# EAGLE design main1 (EAGLE 9.2.2)
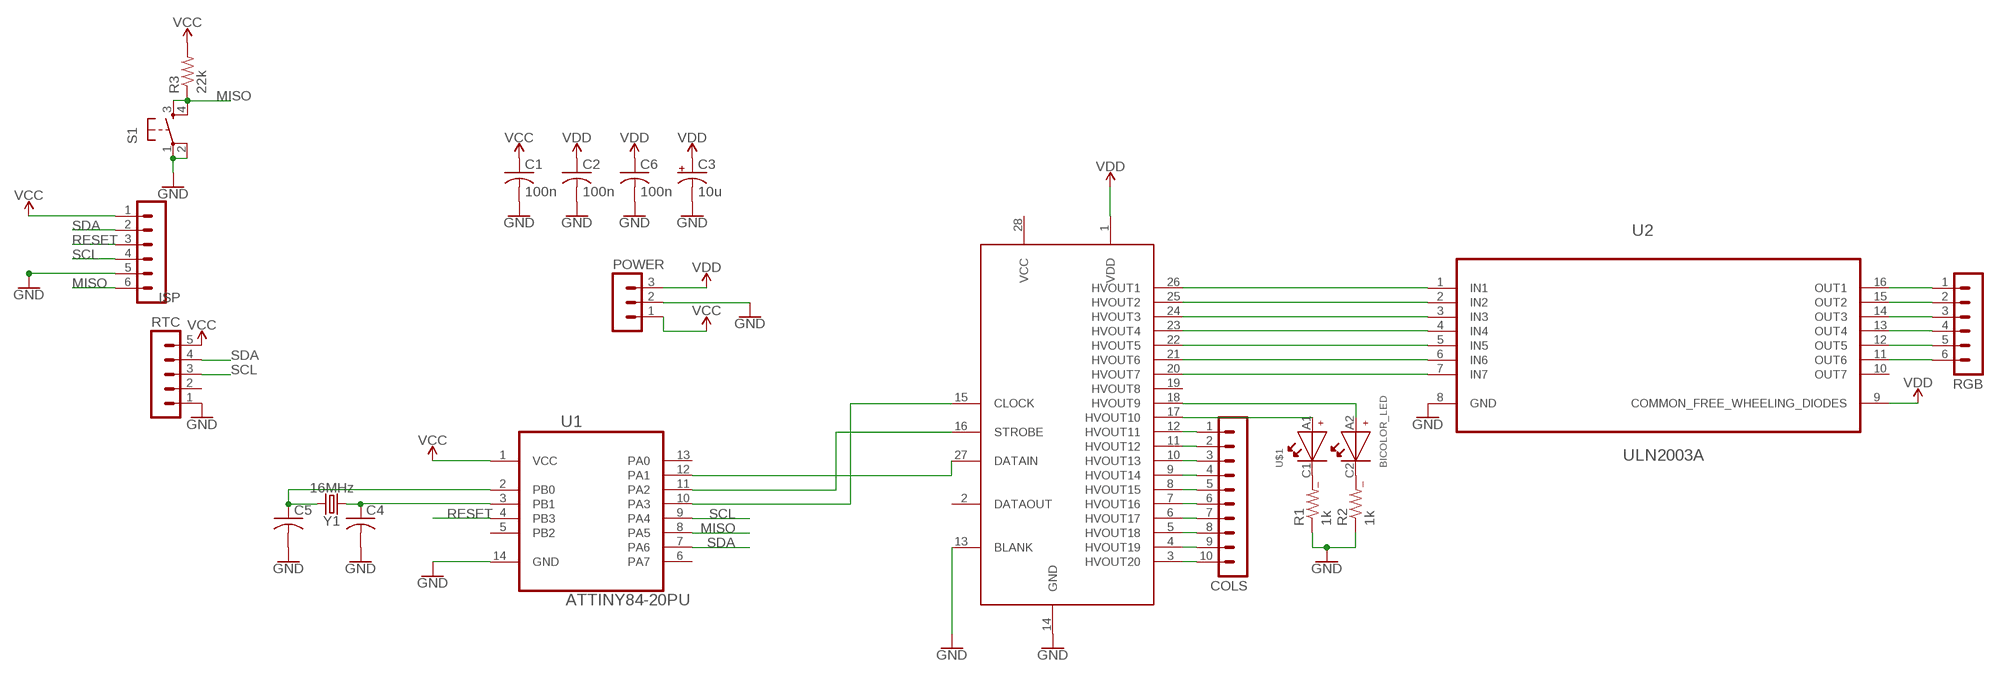
[diagram p0: schematic, sheet 1]

## Parts
C1  100n  C-US025-025X050  [C025-025X050]
C2  100n  C-US025-025X050  [C025-025X050]
C3  10u  CPOL-USE2-5  [E2-5]
C4  C-USC0603K  [C0603K]
C5  C-USC0603K  [C0603K]
C6  100n  C-US025-025X050  [C025-025X050]
COLS  MA10-1W  [MA10-1W]
ISP  MA06-1  [MA06-1]
POWER  MA03-1  [MA03-1]
R1  1k  R-US_R0603  [R0603]
R2  1k  R-US_R0603  [R0603]
R3  22k  R-US_R0603  [R0603]
RGB  MA06-1  [MA06-1]
RTC  MA05-1  [MA05-1]
S1  TAC_SWITCHPTH  [TACTILE-PTH]
U1  ATTINY84-20PU  [DIP254P762X533-14]
U2  ULN2003A  [DIP254P762X508-16]
U$1  BICOLOR_LED  [BICOLOR_LED]
U$2  HV5812  [DIP254P1524X482-28]
Y1  16MHz  CRYSTAL-16MHZPTH-HC49US  [HC49US]

## Nets
GND: C1.2 C2.2 C3.- C4.2 C5.2 C6.2 ISP.5 POWER.2 R1.1 R2.1 RTC.1 S1.1 S1.2 U1.14(GND) U2.8(GND) U$2.13(BLANK) U$2.14(GND)
MISO: ISP.6 R3.1 S1.3 S1.4 U1.8(PA5)
N$1: U2.1(IN1) U$2.26(HVOUT1)
N$2: U2.2(IN2) U$2.25(HVOUT2)
N$3: U2.3(IN3) U$2.24(HVOUT3)
N$4: U2.4(IN4) U$2.23(HVOUT4)
N$5: U2.5(IN5) U$2.22(HVOUT5)
N$6: U2.6(IN6) U$2.21(HVOUT6)
N$7: U2.7(IN7) U$2.20(HVOUT7)
N$8: RGB.1 U2.16(OUT1)
N$9: RGB.2 U2.15(OUT2)
N$10: RGB.3 U2.14(OUT3)
N$11: RGB.4 U2.13(OUT4)
N$12: RGB.5 U2.12(OUT5)
N$13: RGB.6 U2.11(OUT6)
N$14: COLS.1 U$2.12(HVOUT11)
N$15: COLS.2 U$2.11(HVOUT12)
N$16: COLS.3 U$2.10(HVOUT13)
N$17: COLS.4 U$2.9(HVOUT14)
N$18: COLS.5 U$2.8(HVOUT15)
N$19: COLS.6 U$2.7(HVOUT16)
N$20: COLS.7 U$2.6(HVOUT17)
N$21: COLS.8 U$2.5(HVOUT18)
N$22: COLS.9 U$2.4(HVOUT19)
N$23: COLS.10 U$2.3(HVOUT20)
N$24: U$1.A1 U$2.17(HVOUT10)
N$25: U$1.A2 U$2.18(HVOUT9)
N$26: R1.2 U$1.C1
N$27: R2.2 U$1.C2
N$28: U1.10(PA3) U$2.15(CLOCK)
N$29: U1.11(PA2) U$2.16(STROBE)
N$30: U1.12(PA1) U$2.27(DATAIN)
PB0: C5.1 U1.2(PB0) Y1.2
PB1: C4.1 U1.3(PB1) Y1.1
RESET: ISP.3 U1.4(PB3)
SCL: ISP.4 RTC.3 U1.9(PA4)
SDA: ISP.2 RTC.4 U1.7(PA6)
VCC: C1.1 ISP.1 POWER.1 R3.2 RTC.5 U1.1(VCC)
VDD: C2.1 C3.+ C6.1 POWER.3 U2.9(COMMON_FREE_WHEELING_DIODES) U$2.1(VDD)
Unconnected: RTC.2 U1.5(PB2) U1.6(PA7) U1.13(PA0) U2.10(OUT7) U$2.2(DATAOUT) U$2.19(HVOUT8) U$2.28(VCC)

## Library data of the parts
C1 C2 C4-C6 = rcl:C-US: CAPACITOR, American symbol; SPICEPREFIX: C
C3 = rcl:CPOL-US: POLARIZED CAPACITOR, American symbol; SPICEPREFIX: C
COLS = con-lstb:MA10-1W: PIN HEADER; OC_FARNELL: unknown; OC_NEWARK: unknown
ISP RGB = con-lstb:MA06-1: PIN HEADER; OC_FARNELL: unknown; OC_NEWARK: unknown
POWER = con-lstb:MA03-1: PIN HEADER; OC_FARNELL: unknown; OC_NEWARK: unknown
R1-R3 = rcl:R-US_: RESISTOR, American symbol; SPICEPREFIX: R
RTC = con-lstb:MA05-1: PIN HEADER; OC_FARNELL: unknown; OC_NEWARK: unknown
S1 = SparkFun-Retired:TAC_SWITCH: Momentary Switch Button commonly used for reset or general input. Spark Fun Electronics SKU : COM-00097 SMT- SWCH-08247
U1 = Atmel_By_element14_Batch_1-00:ATTINY84-20PU: 8-bit Microcontroller with In-System Programmable Flash; MPN: ATTINY84-20PU; OC_FARNELL: -; OC_NEWARK: 58M3794; PACKAGE: PDIP-14; SUPPLIER: Atmel
U2 = ST Microelctronics_By_element14_Batch_1:ULN2003A: Seven Darlington array; MPN: ULN2003A; OC_FARNELL: 1094421; OC_NEWARK: 89K1130; PACKAGE: 16-DIP; SUPPLIER: STMICROELECTRONICS
U$1 = 7_segment_lib:BICOLOR_LED
U$2 = 7_segment_lib:HV5812
Y1 = SparkFun-Clocks:CRYSTAL-16MHZ: 16MHz Crystal Digikey Example <http://www.digikey.com/product-search/en?keywords=535-9122-1-ND> Frequency: 16MHz Frequency Stability: ±50ppm Frequency Tolerance: ±20ppm Load Capacitance: 18pF SparkFun Products: Pro Micro -5V/16MHz <https://www.sparkfun.com/products/12640> SparkFun Serial Enabled LCD Kit <https://www.sparkfun.com/products/10097>; PROD_ID: XTAL-08181; SF_ID: COM-00536

## Board
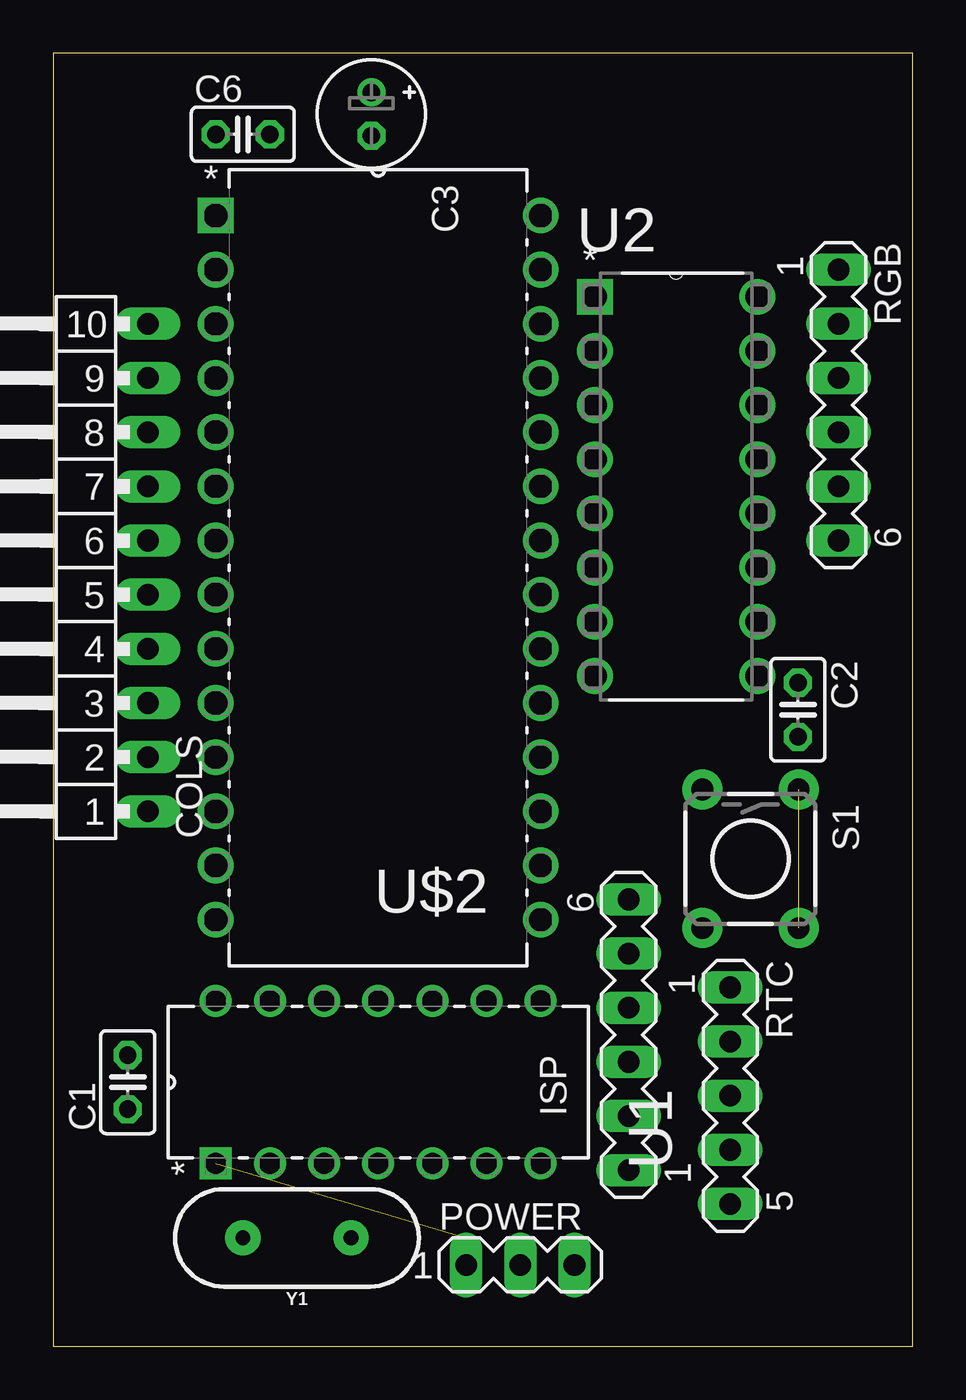
[diagram p1: board, top side]
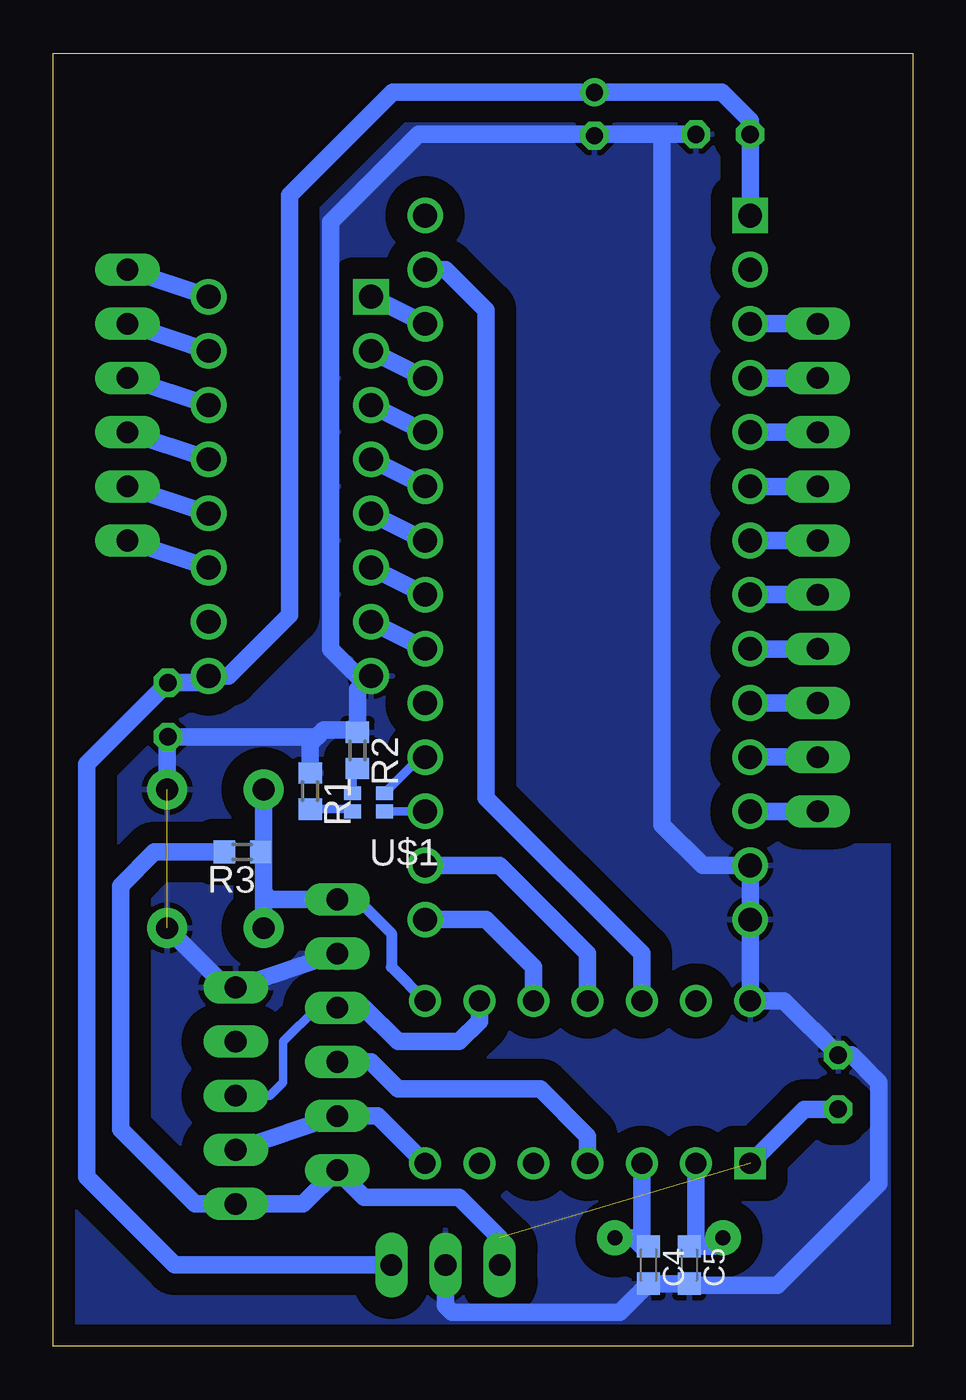
[diagram p2: board, bottom side, seen from below]

Size 40.3 x 60.63 mm. Coordinates in mm from the lower left corner, seen from the top.
Outline: 0,0 40.3,0 40.3,60.63 0,60.63 0,0
Copper layers (1*16): Top 0.035mm / dielectric 1.5mm / Bottom 0.035mm
Design rules "default": minimum track width 6mil, minimum drill 0.35mm, track to track 6mil, track to pad 6mil, pad to pad 6mil, via to via 6mil, smd to smd 6mil, copper to edge 40mil, drill to drill 6mil, minimum pad ring 10mil, minimum via ring 8mil, stop-mask expansion 4mil, vias tented up to drill 0mil, thermal gap 10mil

### Footprints (pad centres in the part's own frame; a part is rotated, then mirrored left to right if it is on the bottom)
C025-025X050 = drill 0.813 octagon: 1 -1.27,0; 2 1.27,0
E2-5 = drill 0.813 pad 1.27: + -1.016,0 | drill 0.813 pad 1.27 octagon: - 1.016,0
C0603K = smd 1.05 x 1.08: 1 -0.875,0; 2 0.875,0
MA10-1W = drill 1.016 long: 1 -11.43,0; 2 -8.89,0; 3 -6.35,0; 4 -3.81,0; 5 -1.27,0; 6 1.27,0; 7 3.81,0; 8 6.35,0; 9 8.89,0; 10 11.43,0
MA06-1 = drill 1.016 long: 1 -6.35,0; 2 -3.81,0; 3 -1.27,0; 4 1.27,0; 5 3.81,0; 6 6.35,0
MA03-1 = drill 1.016 long: 1 -2.54,0; 2 0,0; 3 2.54,0
R0603 = smd 1 x 1.1: 1 -0.85,0; 2 0.85,0
MA05-1 = drill 1.016 long: 1 -5.08,0; 2 -2.54,0; 3 0,0; 4 2.54,0; 5 5.08,0
TACTILE-PTH = drill 1.016 pad 1.88: 1 -3.251,2.261; 2 3.251,2.261; 3 -3.251,-2.261; 4 3.251,-2.261
DIP254P762X533-14 = drill 0.991 square: 1 -7.62,15.24 | drill 0.991: 2 -7.62,12.7; 3 -7.62,10.16; 4 -7.62,7.62; 5 -7.62,5.08; 6 -7.62,2.54; 7 -7.62,0; 8 0,0; 9 0,2.54; 10 0,5.08; 11 0,7.62; 12 0,10.16; 13 0,12.7; 14 0,15.24
DIP254P762X508-16 = drill 1.118 square: 1 -7.62,17.78 | drill 1.118: 2 -7.62,15.24; 3 -7.62,12.7; 4 -7.62,10.16; 5 -7.62,7.62; 6 -7.62,5.08; 7 -7.62,2.54; 8 -7.62,0; 9 0,0; 10 0,2.54; 11 0,5.08; 12 0,7.62; 13 0,10.16; 14 0,12.7; 15 0,15.24; 16 0,17.78
BICOLOR_LED = smd 0.8 x 0.65: A1 0,0; A2 0,-0.85; C1 1.5,0; C2 1.5,-0.85
DIP254P1524X482-28 = drill 1.118 square: 1 -15.24,33.02 | drill 1.118: 2 -15.24,30.48; 3 -15.24,27.94; 4 -15.24,25.4; 5 -15.24,22.86; 6 -15.24,20.32; 7 -15.24,17.78; 8 -15.24,15.24; 9 -15.24,12.7; 10 -15.24,10.16; 11 -15.24,7.62; 12 -15.24,5.08; 13 -15.24,2.54; 14 -15.24,0; 15 0,0; 16 0,2.54; 17 0,5.08; 18 0,7.62; 19 0,10.16; 20 0,12.7; 21 0,15.24; 22 0,17.78; 23 0,20.32; 24 0,22.86; 25 0,25.4; 26 0,27.94; 27 0,30.48; 28 0,33.02
HC49US = drill 0.7 pad 1.651: 1 -2.54,0; 2 2.54,0

### Placement (x,y rotation side)
C1  3.49,12.38 90 top
C2  34.92,29.84 270 top
C3  14.92,57.78 270 top
C4  12.38,3.81 270 bottom
C5  10.48,3.81 270 bottom
C6  8.89,56.83 0 top
COLS  4.45,36.51 90 top
ISP  26.99,14.61 90 top
POWER  21.91,3.81 0 top
R1  28.26,26.04 270 bottom
R2  26.04,27.94 270 bottom
R3  31.43,23.18 180 bottom
RGB  36.83,44.13 270 top
RTC  31.75,11.75 270 top
S1  32.7,22.86 270 top
U1  22.86,16.19 90 top
U2  33.02,31.43 0 top
U$1  24.77,25.08 180 bottom
U$2  22.86,20 0 top
Y1  11.43,5.08 180 top

### Tracks (layer width: path | path; a pad name or v marks a point on that pad's centre or on a via)
GND  (1 unrouted)
  Bottom 0.813: R2.1 26.03,29.21 | 26.03,29.21 26.03,30.8 U2.8 26.03,31.43 27.3,32.7 27.3,52.7 23.18,56.83 14.86,56.83 | C6.2 11.75,56.83 | 11.75,56.83 14.86,56.83 | 14.86,56.83 C3.- | ISP.5 RTC.1 32.18,16.83 S1.2 | S1.1 34.96,28.54 C2.2 27.94,28.57 27.62,28.89 | R1.1 28.26,28.26 27.62,28.89 | 27.62,28.89 26.35,28.89 26.03,29.21 | 11.75,56.83 11.75,24.45 9.84,22.54 U$2.13 U$2.14 U1.14 6.03,16.19 C1.2 2.86,13.65 1.59,12.38 1.59,7.62 6.35,2.86 10.4,2.86 C5.2 C4.2 13.73,1.59 21.59,1.59 21.91,1.91 POWER.2
  pour Bottom (isolate 1.016): 0,60.64 0,48.58 4.45,48.58 4.45,23.5 0,23.5 0,0 40.32,0 40.32,60.64
MISO
  Bottom 0.508: ISP.6 26.03,20.95 24.45,19.37 24.45,17.78 U1.8
  Bottom 0.813: S1.4 30.44,21.27 | 30.44,21.27 S1.3 | R3.1 30.44,23.04 30.44,21.27 | ISP.6 30.12,20.95 30.44,21.27
N$1
  Bottom 0.813: U$2.26 U2.1
N$2
  Bottom 0.813: U$2.25 U2.2
N$3
  Bottom 0.813: U$2.24 U2.3
N$4
  Bottom 0.813: U$2.23 U2.4
N$5
  Bottom 0.813: U$2.22 U2.5
N$6
  Bottom 0.813: U$2.21 U2.6
N$7
  Bottom 0.813: U$2.20 U2.7
N$8
  Bottom 0.813: U2.16 RGB.1
N$9
  Bottom 0.813: U2.15 RGB.2
N$10
  Bottom 0.813: U2.14 RGB.3
N$11
  Bottom 0.813: U2.13 RGB.4
N$12
  Bottom 0.813: U2.12 RGB.5
N$13
  Bottom 0.813: U2.11 RGB.6
N$14
  Bottom 0.813: COLS.1 U$2.12
N$15
  Bottom 0.813: U$2.11 COLS.2
N$16
  Bottom 0.813: COLS.3 U$2.10
N$17
  Bottom 0.813: U$2.9 COLS.4
N$18
  Bottom 0.813: COLS.5 U$2.8
N$19
  Bottom 0.813: COLS.6 U$2.7
N$20
  Bottom 0.813: U$2.6 COLS.7
N$21
  Bottom 0.813: COLS.8 U$2.5
N$22
  Bottom 0.813: U$2.4 COLS.9
N$23
  Bottom 0.813: COLS.10 U$2.3
N$24
  Bottom 0.406: U$2.17 U$1.A1
N$25
  Bottom 0.406: U$1.A2 23.07,27.62 U$2.18
N$26
  Bottom 0.406: U$1.C1 26.37,25.18 R1.2
N$27
  Bottom 0.406: U$1.C2 26.26,26.86 R2.2
N$28
  Bottom 0.813: U1.10 17.78,17.78 20,20 U$2.15
N$29
  Bottom 0.813: U$2.16 19.37,22.54 15.24,18.41 U1.11
N$30
  Bottom 0.813: U$2.27 21.91,50.48 20,48.58 20,25.72 12.7,18.41 U1.12
PB0
  Bottom 0.813: U1.2 10.16,5 | 10.16,5 10.16,4.68 9.28,4.68 Y1.2 | 10.16,5 C5.1
PB1
  Bottom 0.813: C4.1 12.7,5 | 12.7,5 12.7,4.68 13.09,5.08 Y1.1 | 12.7,5 U1.3
RESET
  Bottom 0.813: ISP.3 25.4,13.34 24.13,12.06 17.46,12.06 15.24,9.84 U1.4
SCL
  Bottom 0.406: ISP.4 27.94,15.88 29.53,14.29 29.53,12.38 30.16,11.75 RTC.3
  Bottom 0.813: U1.9 20.32,15.24 21.27,14.29 24.13,14.29 25.72,15.88 ISP.4
SDA
  Bottom 0.813: RTC.4 ISP.2 25.08,10.79 U1.7
VCC  (1 unrouted)
  Bottom 0.813: C1.1 5.08,11.11 U1.1 | POWER.1 19.37,5.08 21.27,6.99 25.72,6.99 ISP.1 28.57,6.67 RTC.5 33.65,6.67 37.15,10.16 37.15,21.59 35.56,23.18 R3.2
VDD
  Bottom 0.813: U$2.1 C6.1 7.62,57.47 8.95,58.8 C3.+ 24.38,58.8 29.21,53.98 29.21,34.29 32.07,31.43 U2.9 33.34,31.11 C2.1 38.74,27.3 38.74,7.94 34.61,3.81 POWER.3